# Altium schematic sheet AP1220_CONTROL.SchDoc
size B; Organization: Altium Limited; Address1: L3, 12a Rodborough Rd; Address2: Frenchs Forest; Address3: NSW; Address4: Australia 2086
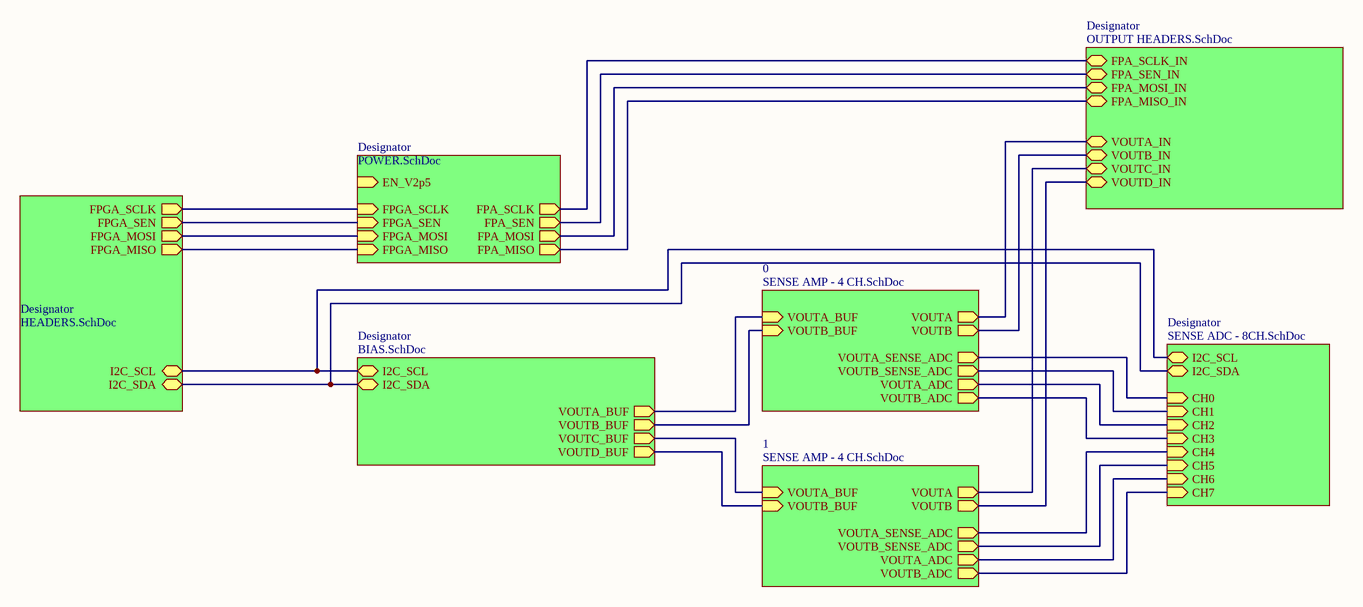
[diagram p0: AP1220_CONTROL.SchDoc]

## Sub-sheets
0 = SENSE AMP - 4 CH.SchDoc: VOUTA_BUF (in), VOUTB_BUF (in), VOUTA (out), VOUTB (out), VOUTA_SENSE_ADC (out), VOUTB_SENSE_ADC (out), VOUTA_ADC (out), VOUTB_ADC (out)
1 = SENSE AMP - 4 CH.SchDoc: VOUTA_BUF (in), VOUTB_BUF (in), VOUTA (out), VOUTB (out), VOUTA_SENSE_ADC (out), VOUTB_SENSE_ADC (out), VOUTA_ADC (out), VOUTB_ADC (out)
Designator = HEADERS.SchDoc: I2C_SCL (bidir), I2C_SDA (bidir), FPGA_SEN (out), FPGA_MOSI (out), FPGA_MISO (out), FPGA_SCLK (out)
Designator = BIAS.SchDoc: I2C_SCL (bidir), I2C_SDA (bidir), VOUTA_BUF (out), VOUTD_BUF (out), VOUTB_BUF (out), VOUTC_BUF (out)
Designator = POWER.SchDoc: EN_V2p5 (in), FPGA_SEN (in), FPGA_MOSI (in), FPGA_MISO (in), FPGA_SCLK (in), FPA_SCLK (out), FPA_SEN (out), FPA_MOSI (out), FPA_MISO (out)
Designator = SENSE ADC - 8CH.SchDoc: I2C_SCL (bidir), I2C_SDA (bidir), CH0 (in), CH1 (in), CH2 (in), CH3 (in), CH4 (in), CH5 (in), CH6 (in), CH7 (in)
Designator = OUTPUT HEADERS.SchDoc: VOUTA_IN, VOUTB_IN, VOUTC_IN, VOUTD_IN, FPA_SCLK_IN, FPA_SEN_IN, FPA_MOSI_IN, FPA_MISO_IN

## Nets
(unnamed): sheet Designator/I2C_SCL, sheet Designator/I2C_SCL, sheet Designator/I2C_SCL
(unnamed): sheet Designator/I2C_SDA, sheet Designator/I2C_SDA, sheet Designator/I2C_SDA
(unnamed): sheet Designator/FPGA_SEN, sheet Designator/FPGA_SEN
(unnamed): sheet Designator/FPGA_MOSI, sheet Designator/FPGA_MOSI
(unnamed): sheet Designator/FPGA_MISO, sheet Designator/FPGA_MISO
(unnamed): sheet Designator/FPGA_SCLK, sheet Designator/FPGA_SCLK
(unnamed): sheet Designator/VOUTA_BUF, sheet 0/VOUTA_BUF
(unnamed): sheet Designator/VOUTD_BUF, sheet 1/VOUTB_BUF
(unnamed): sheet Designator/VOUTB_BUF, sheet 0/VOUTB_BUF
(unnamed): sheet Designator/VOUTC_BUF, sheet 1/VOUTA_BUF
(unnamed): sheet Designator/FPA_SCLK, sheet Designator/FPA_SCLK_IN
(unnamed): sheet Designator/FPA_SEN, sheet Designator/FPA_SEN_IN
(unnamed): sheet Designator/FPA_MOSI, sheet Designator/FPA_MOSI_IN
(unnamed): sheet Designator/FPA_MISO, sheet Designator/FPA_MISO_IN
(unnamed): sheet 0/VOUTA, sheet Designator/VOUTA_IN
(unnamed): sheet 0/VOUTB, sheet Designator/VOUTB_IN
(unnamed): sheet 0/VOUTA_SENSE_ADC, sheet Designator/CH0
(unnamed): sheet 0/VOUTB_SENSE_ADC, sheet Designator/CH1
(unnamed): sheet 0/VOUTA_ADC, sheet Designator/CH2
(unnamed): sheet 0/VOUTB_ADC, sheet Designator/CH3
(unnamed): sheet 1/VOUTA, sheet Designator/VOUTC_IN
(unnamed): sheet 1/VOUTB, sheet Designator/VOUTD_IN
(unnamed): sheet 1/VOUTA_SENSE_ADC, sheet Designator/CH4
(unnamed): sheet 1/VOUTB_SENSE_ADC, sheet Designator/CH5
(unnamed): sheet 1/VOUTA_ADC, sheet Designator/CH6
(unnamed): sheet 1/VOUTB_ADC, sheet Designator/CH7

## Notes on the sheet
- Title
- Size:
- Date:
- B
- Number:
- Time:
- Revision:
- Sheet
- of
- File: